# Altium schematic sheet CW340_INPUT_POWER.SchDoc: 5V Regulator
size Letter; Organization: NewAE Technology Inc.; Address1: 1083 Queen St., Suite 196; Address2: Halifax; Address3: NS; Address4: Canada B3H 0B2; DocumentNumber: .; Revision: .; SheetNumber: 3; SheetTotal: 31; SheetApproved: Yes
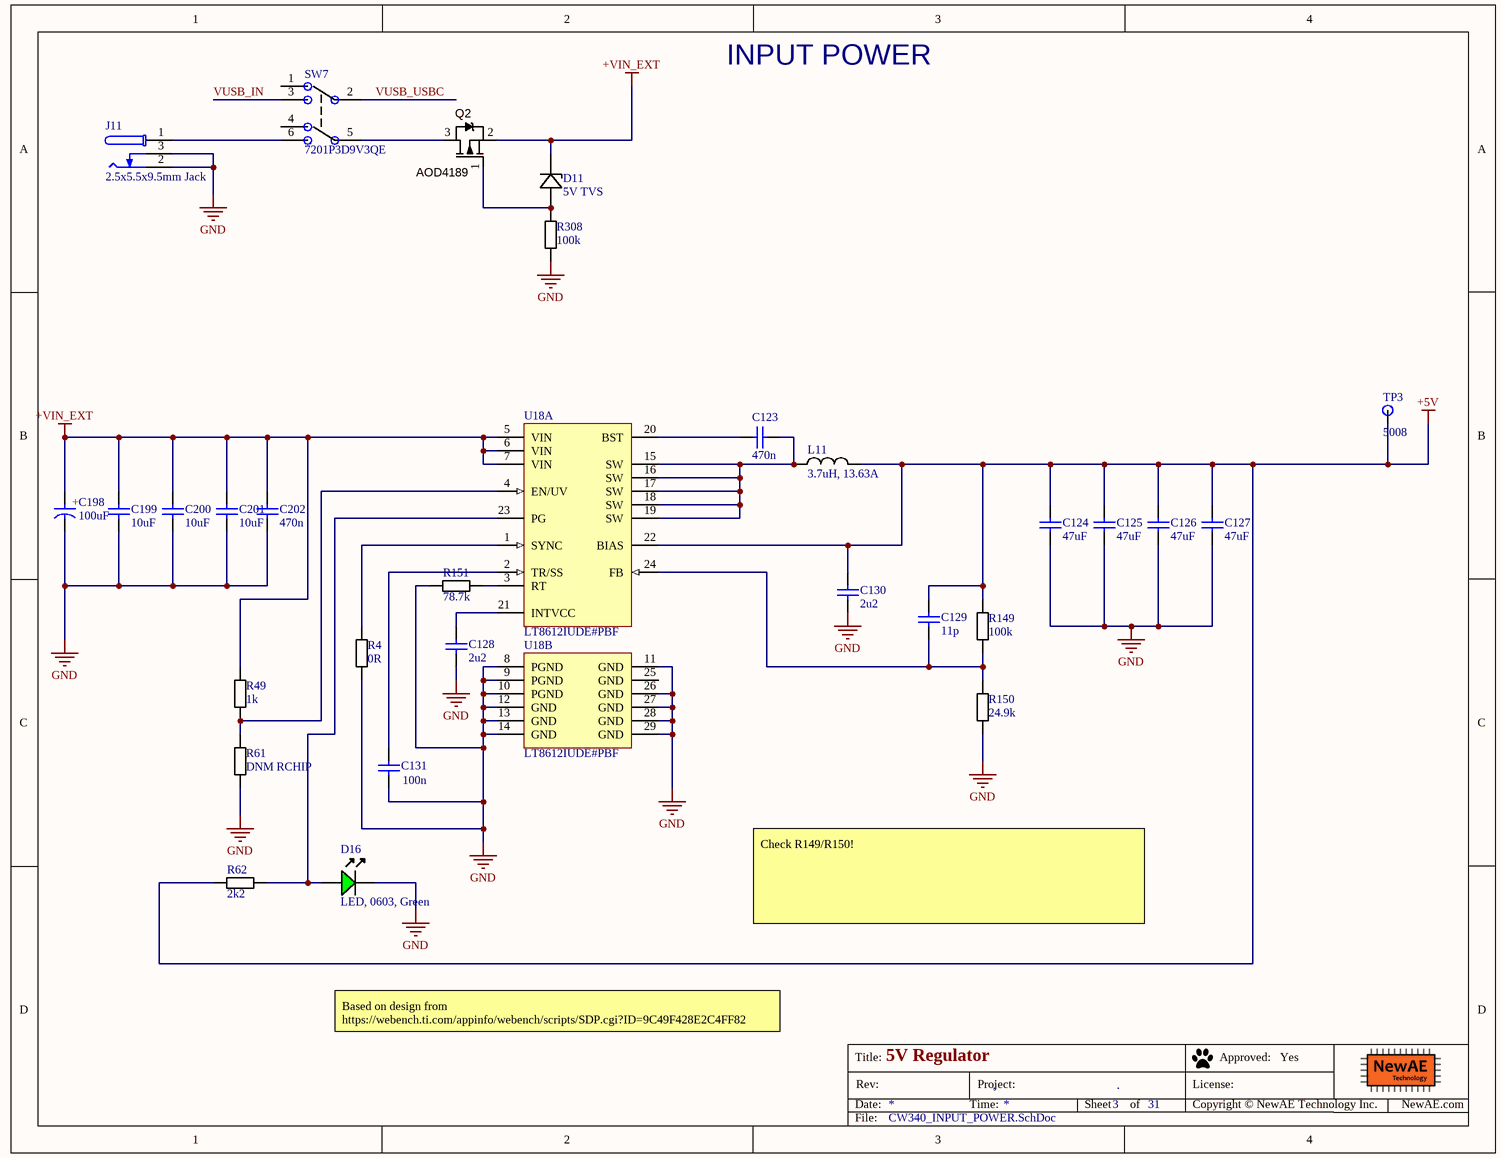
[diagram p0: CW340_INPUT_POWER.SchDoc]

## Parts
C123  470n  [CAPC0603_M]
C124  47uF  [CAPC3225X20N]
C125  47uF  [CAPC3225X20N]
C126  47uF  [CAPC3225X20N]
C127  47uF  [CAPC3225X20N]
C128  2u2  [CAPC0603_M]
C129  11p  [RESC1608X55N]
C130  2u2  [CAPC0603_M]
C131  100n  [CAPC0603_M]
C198  100uF  [CAP_AL_D6.3]
C199  10uF  [CAPC3225X20N]
C200  10uF  [CAPC3225X20N]
C201  10uF  [CAPC3225X20N]
C202  470n  [CAPC1206_M]
D11  5V TVS  [SOD-523]
D16  LED, 0603, Green  [LED-0603-GREEN]
J11  2.5x5.5x9.5mm Jack  [CUI_PJ-058BH]
L11  3.7uH, 13.63A  [MLC1565 SERIES]
Q2  AOD4189  [DPAK_TO-252AA_M]
R4  0R  [RESC1005X40N]
R49  1k  [RESC1608X55N]
R61  DNM RCHIP  [RESC1608X55N]
R62  2k2  [RESC1608X55N]
R149  100k  [RESC1608X55N]
R150  24.9k  [RESC1608X55N]
R151  78.7k  [RESC1608X55N]
R308  100k  [RESC1608X55N]
SW7  7201P3D9V3QE  [7201P3D9V3QE]
TP3  5008  [KEYSTONE5008]
U18  LT8612IUDE#PBF  [LT-UDE-28_V]  (parts A,B of 2)

## Nets
+5V: C124.1 C125.1 C126.1 C127.1 C129.1 C130.1 L11.2 R62.1 R149.1 TP3.1 U18.22(BIAS)
+VIN_EXT: C198.1 C199.1 C200.1 C201.1 C202.1 D11.1(K) Q2.2(S) R49.1 U18.5(VIN) U18.6(VIN) U18.7(VIN)
GND: C124.2 C125.2 C126.2 C127.2 C128.2 C130.2 C131.2 C198.2 C199.2 C200.2 C201.2 C202.2 D16.K J11.2 J11.3 R4.1 R61.2 R150.2 R151.1 R308.2 U18.8(PGND) U18.9(PGND) U18.10(PGND) U18.11(GND) U18.12(GND) U18.13(GND) U18.14(GND) U18.26(GND) U18.27(GND) U18.28(GND) U18.29(GND)
VUSB_IN: SW7.3(IN)
VUSB_USBC: SW7.2(IN)
NetC123_1: C123.1 U18.20(BST)
NetC123_2: C123.2 L11.1 U18.15(SW) U18.16(SW) U18.17(SW) U18.18(SW) U18.19(SW)
NetC128_1: C128.1 U18.21(INTVCC)
NetC129_2: C129.2 R149.2 R150.1 U18.24(FB)
NetC131_1: C131.1 U18.2(TR/SS)
NetD11_2: D11.2(A) Q2.1(G) R308.1
NetD16_A: D16.A R62.2 U18.23(PG)
NetJ11_1: J11.1 SW7.6(IN)
NetQ2_3: Q2.3(D) SW7.5(IN)
NetR4_2: R4.2 U18.1(SYNC)
NetR49_2: R49.2 R61.1 U18.4(EN/UV)
NetR151_2: R151.2 U18.3(RT)

Not connected (* = marked no-connect by the designer): SW7 1(IN) 4(IN); U18 25(GND)

## Notes on the sheet
- INPUT POWER
- Check R149/R150!
- Based on design from https://webench.ti.com/appinfo/webench/scripts/SDP.cgi?ID=9C49F428E2C4FF82
- Title:
- Date:
- Rev:
- Time:
- Project:
- Sheet
- of
- License:
- Copyright © NewAE Technology Inc.
- Approved:
- NewAE.com
- File:
- (in symbol Cap_35v_100uF) +

## Library data of the parts
C123 = CCHIP-470n-0603-50V: 470n, 0603, 50V; Manufacture 1: Taiyo Yuden; Manufacture Part Number 1: UMK107B7474KA-TR; Component Group: Capacitor; Case-EIA: 0603; Rated Voltage: 50VDC; Part Number: CCHIP-470n-0603-50V; Footprint: 0603; Pin Count: 2; Supplier 1: Digi-Key; Supplier Part Number 1: 587-3170-1-ND; Value: 470n; Mounting Technology: SMT; RoHS: Yes; Temperature Range: -55C to 125C; Component Kind: Standard; Component Type: Standard
C124-C127 = CCHIP-47u-1210: 47u, 10V, 1210, Ceramic; Manufacture 1: TDK Corporation; Manufacture Part Number 1: C3225X5R1A476M250AC; Component Group: Capacitor; Case-EIA: 1210; Case-Metric: 3225; Rated Voltage: 10VDC; Tolerance: 20%; Part Number: CCHIP-47u-1210; Footprint: 1210; Pin Count: 2; Supplier 1: Digi-Key; Supplier Part Number 1: 445-6711-1-ND; Value: 47uF; Mounting Technology: SMT; Temperature Range: -55C to 85C; Component Kind: Standard; Component Type: Standard
C128 = CCHIP-2u2-0603-16V: 2u2, 0603; Manufacture 1: Taiyo Yuden; Manufacture Part Number 1: EMK107BJ225KA-T; Component Group: Capacitor; Case-EIA: 0603; Case-Metric: 1608; Rated Voltage: 16VDC; Part Number: CCHIP-2u2-0603-16V; Footprint: 0603; Pin Count: 2; Supplier 1: Digi-Key; Supplier Part Number 1: 587-1430-1-ND; Value: 2u2; Mounting Technology: SMT; Component Kind: Standard; Component Type: Standard
C129 = CCHIP-11P-0603-50V: CAP CER 11PF 50V C0G/NP0 0603; Manufacture 1: Murata Electronics North America; Manufacture Part Number 1: GRM1885C1H510JA01D; Component Group: Capacitor; Case-EIA: 0603; Case-Metric: 1608; Tolerance: ±5%; PP Material Stack: 0; Part Number: CCHIP-11P-0603-50V; Footprint: 0603; Pin Count: 2; Value: 11p; Rated Voltage: 50V; Mounting Technology: SMT; Component Kind: Standard; Component Type: Standard; PP Rotation: 0; Supplier 1: Arrow Electronics; Supplier Part Number 1: GRM1885C1H110JA01D
C130 = CCHIP-2u2-0603: 2u2, 0603; Manufacture 1: Samsung; Manufacture Part Number 1: CL10B225KP8NNNC; Component Group: Capacitor; Case-EIA: 0603; Case-Metric: 1608; Rated Voltage: 10VDC; Part Number: CCHIP-2u2-0603; Footprint: 0603; Pin Count: 2; Supplier 1: Digi-Key; Supplier Part Number 1: 1276-1134-1-ND; LCSC Equivalent: C57895; Value: 2u2; Mounting Technology: SMT; Component Kind: Standard; Component Type: Standard
C131 = CCHIP-100n-0603: 100n, 0603; Manufacture 1: Kemet; Manufacture Part Number 1: C0603C104K5RACTU; Component Group: Capacitor; Case-EIA: 0603; Case-Metric: 1608; Rated Voltage: 50VDC; Part Number: CCHIP-100n-0603; Footprint: 0603; Pin Count: 2; Supplier 1: Digi-Key; Supplier Part Number 1: 399-5089-2-ND; LCSC Equivalent: C1591; Value: 100n; Mounting Technology: SMT; Component Kind: Standard; Component Type: Standard
C198 = Cap_35v_100uF: CAP ALUM 100UF 20% 35V RADIAL; Manufacture 1: Panasonic Electronic Components; Manufacture Part Number 1: ECA-1VM101; Component Group: Capacitor; PP Material Stack: 0; Part Number: Cap_35v_100uF; Pin Count: 2; Supplier 1: Digi-Key; Supplier Part Number 1: P5165-ND; Value: 100uF; Mounting Technology: Through-hole; RoHS: Yes; Component Kind: Standard; Component Type: Standard; PP Rotation: 0
C199-C201 = CCHIP-10u-1210-50V: 10u, 50V, 1210, Ceramic; Manufacture 1: Samsung Electro-Mechanics; Manufacture Part Number 1: CL32B106KBJNNWE; Component Group: Capacitor; Case-EIA: 1210; Case-Metric: 3225; Tolerance: 10%; Part Number: CCHIP-10u-1210-50V; Footprint: 1210; Pin Count: 2; Supplier 1: Digi-Key; Supplier Part Number 1: 1276-3388-1-ND; Value: 10uF; Rated Voltage: 50V; Mounting Technology: SMT; Temperature Range: -55C to 85C; Component Kind: Standard; Component Type: Standard
C202 = CCHIP-470n-1206-100V: 470n, 1206, 100V; Manufacture 1: TDK Corporation; Manufacture Part Number 1: C3216X7R2A474K160AA; Component Group: Capacitor; Tolerance: 10%; PP Material Stack: 0; Part Number: CCHIP-470n-1206-100V; Footprint: 1206; Pin Count: 2; Supplier 1: Digi-Key; Supplier Part Number 1: 445-2284-1-ND; Value: 470n; Mounting Technology: SMT; Component Kind: Standard; Component Type: Standard; PP Rotation: 0
D11 = VESD05B1-02V-G3-08: TVS DIODE 1VSO 5VBD SOD523; Manufacture 1: Vishay; PP Material Stack: 0; Part Number: VESD05B1-02V-G3-08; Component Group: Diode; Manufacture Part Number 1: VESD05B1-02V-G3-08; Pin Count: 2; Supplier 1: Digi-Key; Supplier Part Number 1: VESD05B1-02V-G3-08GICT-ND; Mounting Technology: SMT; RoHS: Yes; Component Kind: Standard; Component Type: Standard; PP Rotation: 0
D16 = LEDCHIP_0603_GREEN: Chip LED, Green; Manufacture 1: Kingbright; Manufacture Part Number 1: APT1608CGCK; Component Group: Optical; PP Material Stack: 16; PP Rotation: -90; Part Number: LEDCHIP_0603_GREEN; Pin Count: 2; Supplier 1: Digi-Key; Supplier Part Number 1: 754-1116-1-ND; Mounting Technology: SMT; Component Kind: Standard; Component Type: Standard
J11 = CUI_PJ-058BH: CONN PWR JACK 2.5X5.5MM SOLDER; Manufacture 1: CUI Inc.; Component Group: Connector; Rated Power: 5A; PP Material Stack: 0; Part Number: CUI_PJ-058BH; Manufacture Part Number 1: PJ-058BH; Pin Count: 3; Supplier 1: Digi-Key; Supplier Part Number 1: CP-058BH-ND; Mounting Technology: Through-hole; RoHS: Yes; Component Kind: Standard; Component Type: Standard; PP Rotation: 0
L11 = MLC1565-372MLB: Manufacture 1: Coilcraft; Component Group: Inductor; Value: 3.7uH, 13A; PP Material Stack: 0; Part Number: MLC1565-372MLB; Footprint: MLC1565; Manufacture Part Number 1: MLC1565-372MLB; Pin Count: 2; Supplier 1: Mouser; Mounting Technology: SMT; RoHS: Yes; Component Kind: Standard; Component Type: Standard; PP Rotation: 0
Q2 = AOD4189: MOSFET P-CH 40V 40A TO252; Manufacture 1: Alpha & Omega Semi; Part Number: AOD4189; Component Group: MOSFET; Footprint: DPAK; Manufacture Part Number 1: AOD4189; Pin Count: 3; Supplier 1: Digi-Key; Supplier Part Number 1: 785-1351-1-ND; Rated Power: 40A; Rated Voltage: 40V; Mounting Technology: SMT; RoHS: Yes; Component Kind: Standard; Component Type: Standard
R4 = RCHIP-0R-0402: Manufacture 1: Yageo; Manufacture Part Number 1: RC0402FR-070RL; Component Group: Resistor; Case-EIA: 0402; Case-Metric: 1005; Part Number: RCHIP-0R-0402; Footprint: 0402; Pin Count: 2; Value: 0R; Component Kind: Standard; Component Type: Standard; Supplier 1: Digi-Key; Supplier Part Number 1: 311-0.0LRCT-ND
R49 = RCHIP-1K-0603: 1k res, 0603, 1%, 1/10W; Manufacture 1: Yageo; Manufacture Part Number 1: RC0603FR-071KL; Component Group: Resistor; Case-EIA: 0603; Case-Metric: 1608; Rated Power: 0.1W; Rated Voltage: 75VDC; Part Number: RCHIP-1K-0603; Footprint: 0603; Pin Count: 2; Supplier 1: Digi-Key; Supplier Part Number 1: 311-1.00KHRCT-ND; Value: 1k; Tolerance: 1%; Mounting Technology: SMT; Temperature Range: -55C to 155C; Component Kind: Standard; Component Type: Standard
R61 = RCHIP-DNM-0603: Do Not Mount Resistor; Case-EIA: 0603; Case-Metric: 1608; Part Number: RCHIP-DNM-0603; Component Group: Resistor; Footprint: 0603; Pin Count: 2; Mounting Technology: SMT; Component Kind: Standard; Component Type: Standard
R62 = RCHIP-2K2-0603: 2k2 res, 0603, 1%, 1/10W; Manufacture 1: Yageo; Manufacture Part Number 1: RC0603FR-072K2L; Component Group: Resistor; Case-EIA: 0603; Case-Metric: 1608; Rated Power: 0.1W; Rated Voltage: 75VDC; Part Number: RCHIP-2K2-0603; Footprint: 0603; Pin Count: 2; Supplier 1: Digi-Key; Supplier Part Number 1: 311-2.20KHRCT-ND; Value: 2k2; Tolerance: 1%; Mounting Technology: SMT; Temperature Range: -55C to 155C; Component Kind: Standard; Component Type: Standard
R149 R308 = RCHIP-100K-0603: 100k res, 0603, 1%, 1/10W; Manufacture 1: Yageo; Manufacture Part Number 1: RC0603FR-07100KL; Component Group: Resistor; Case-EIA: 0603; Case-Metric: 1608; Rated Power: 0.1W; Rated Voltage: 75VDC; Part Number: RCHIP-100K-0603; Footprint: 0603; Pin Count: 2; Supplier 1: Digi-Key; Supplier Part Number 1: 311-100KHRCT-ND; Value: 100k; Tolerance: 1%; Mounting Technology: SMT; Temperature Range: -55C to 155C; Component Kind: Standard; Component Type: Standard
R150 = RCHIP-24K9-0603: 24k9 res, 0603, 1%, 1/10W; Manufacture 1: Yageo; Manufacture Part Number 1: RC0603FR-0724K9L; Component Group: Resistor; Case-EIA: 0603; Case-Metric: 1608; Rated Power: 0.1W; Rated Voltage: 75VDC; PP Notes: Standard; Part Number: RCHIP-24K9-0603; Footprint: 0603; Pin Count: 2; Supplier 1: Digi-Key; Supplier Part Number 1: 311-24.9KHRCT-ND; Value: 24.9k; Tolerance: 1%; Component Kind: -55C to 155C; Component Type: Standard; Orientation: SMT
R151 = RCHIP-78k7-0603: 78k7 res, 0603, 1%, 1/10W; Manufacture 1: Yageo; Manufacture Part Number 1: RC0603FR-078K7L; Component Group: Resistor; Case-EIA: 0603; Case-Metric: 1608; Rated Power: 0.1W; Rated Voltage: 75VDC; Part Number: RCHIP-78k7-0603; Footprint: 0603; Pin Count: 2; Supplier 1: Digi-Key; Value: 78.7k; Tolerance: 1%; Mounting Technology: SMT; Temperature Range: -55C to 155C; Component Kind: Standard; Component Type: Standard; Supplier Part Number 1: 311-78.7KHRCT-ND
SW7 = 7201P3D9V3QE: DPDT, Switch, TH; Manufacture 1: CK Switch; PP Material Stack: 0; Part Number: 7201P3D9V3QE; Component Group: Switch; Manufacture Part Number 1: 7201P3D9V3QE; Pin Count: 8; Supplier 1: Digi-Key; Component Kind: Standard; Component Type: Standard; PP Rotation: 0; PP Rotation1: 0
TP3 = KEYSTONE_5008: TEST POINT PC COMPACT .063"D ORG; Part Number: KEYSTONE_5008; Component Group: Test Point; Pin Count: 1; Supplier 1: Digi-Key; Supplier Part Number 1: 36-5008-ND; Mounting Technology: Through-hole; Component Kind: Standard; Component Type: Standard
U18 = CMP-0492-02659-1: Synchronous Step-Down Regulator, 3.4 to 42 V, -40 to 125 degC, 28-Pin PQFN (UDE), RoHS, Tube; Manufacturer: Linear Technology; VOUT: 0.97 to 41.6 V; Number of Outputs: 1; fSW: 0.2 to 2.2 MHz; IOUT: 6 A; DatasheetVersion: Dec-13; VIN: 3.4 to 42 V; RoHS: TRUE; Temperature Range: -40 to 125 degC; ComponentLink2URL: http://cds.linear.com/docs/en/datasheet/8612f.pdf; PackageVersion: Rev. Ã˜; PackageDescription: 28-Pin Plastic Quad Flat No-lead Package, Body 6 x 3 mm, Pitch 0.5 mm; Mounting Technology: Surface Mount; ComponentLink1Description: Manufacturer URL; ComponentLink3Description: Package Specification; ComponentLink2Description: Datasheet; ComponentLink1URL: http://www.linear.com/; ComponentLink3URL: http://cds.linear.com/docs/en/packaging/05081926_0_UDE28.pdf; PartNumber: LT8612IUDE#PBF; Packing: Tube